# Altium schematic sheet MCUs.SchDoc
size B; SheetNumber: 8; SheetTotal: 8
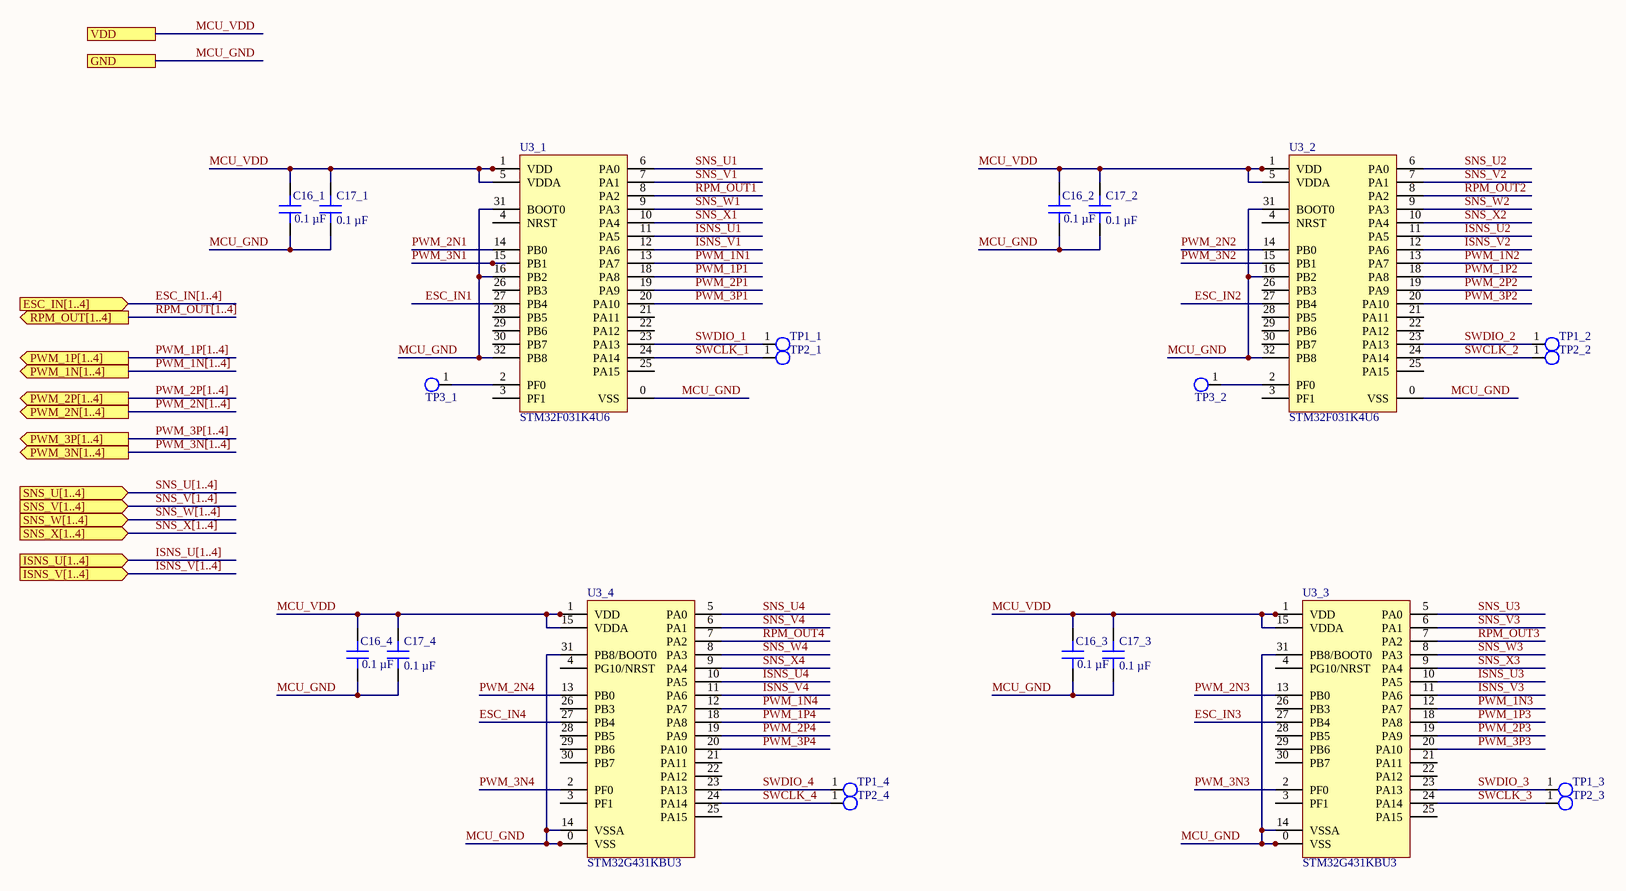
[diagram p0: MCUs.SchDoc]

## Parts
C16_1  0.1 µF  [CAP 0402_1005]
C16_2  0.1 µF  [CAP 0402_1005]
C16_3  0.1 µF  [CAP 0402_1005]
C16_4  0.1 µF  [CAP 0402_1005]
C17_1  0.1 µF  [CAP 0402_1005]
C17_2  0.1 µF  [CAP 0402_1005]
C17_3  0.1 µF  [CAP 0402_1005]
C17_4  0.1 µF  [CAP 0402_1005]
TP1_1  0.635mm  [TP  0.635mm]  (value not drawn)
TP1_2  0.635mm  [TP  0.635mm]  (value not drawn)
TP1_3  0.635mm  [TP  0.635mm]  (value not drawn)
TP1_4  0.635mm  [TP  0.635mm]  (value not drawn)
TP2_1  0.635mm  [TP  0.635mm]  (value not drawn)
TP2_2  0.635mm  [TP  0.635mm]  (value not drawn)
TP2_3  0.635mm  [TP  0.635mm]  (value not drawn)
TP2_4  0.635mm  [TP  0.635mm]  (value not drawn)
TP3_1  0.635mm  [TP  0.635mm]  (value not drawn)
TP3_2  0.635mm  [TP  0.635mm]  (value not drawn)
U3_1  STM32F031K4U6  [QFN50P400X400X60-32N]
U3_2  STM32F031K4U6  [QFN50P400X400X60-32N]
U3_3  STM32G431KBU3  [QFN50P400X400X60-32N]
U3_4  STM32G431KBU3  [QFN50P400X400X60-32N]

## Ports
ESC_IN[1..4] (in), GND, ISNS_U[1..4] (in), ISNS_V[1..4] (in), PWM_1N[1..4] (out), PWM_1P[1..4] (out), PWM_2N[1..4] (out), PWM_2P[1..4] (out), PWM_3N[1..4] (out), PWM_3P[1..4] (out), RPM_OUT[1..4] (out), SNS_U[1..4] (in), SNS_V[1..4] (in), SNS_W[1..4] (in), SNS_X[1..4] (in), VDD

## Nets
ESC_IN1: U3_1.27(PB4)
ESC_IN2: U3_2.27(PB4)
ESC_IN3: U3_3.27(PB4)
ESC_IN4: U3_4.27(PB4)
ISNS_U1: U3_1.11(PA5)
ISNS_U2: U3_2.11(PA5)
ISNS_U3: U3_3.10(PA5)
ISNS_U4: U3_4.10(PA5)
ISNS_V1: U3_1.12(PA6)
ISNS_V2: U3_2.12(PA6)
ISNS_V3: U3_3.11(PA6)
ISNS_V4: U3_4.11(PA6)
MCU_GND: C16_1.1 C16_2.1 C16_3.1 C16_4.1 C17_1.1 C17_2.1 C17_3.1 C17_4.1 U3_1.0(VSS) U3_1.16(PB2) U3_1.31(BOOT0) U3_1.32(PB8) U3_2.0(VSS) U3_2.16(PB2) U3_2.31(BOOT0) U3_2.32(PB8) U3_3.0(VSS) U3_3.14(VSSA) U3_3.16(VSS) U3_3.31(PB8/BOOT0) U3_3.32(VSS) U3_4.0(VSS) U3_4.14(VSSA) U3_4.16(VSS) U3_4.31(PB8/BOOT0) U3_4.32(VSS) ; port GND
MCU_VDD: C16_1.2 C16_2.2 C16_3.2 C16_4.2 C17_1.2 C17_2.2 C17_3.2 C17_4.2 U3_1.1(VDD) U3_1.5(VDDA) U3_1.17(VDD) U3_2.1(VDD) U3_2.5(VDDA) U3_2.17(VDD) U3_3.1(VDD) U3_3.15(VDDA) U3_3.17(VDD) U3_4.1(VDD) U3_4.15(VDDA) U3_4.17(VDD) ; port VDD
PWM_1N1: U3_1.13(PA7)
PWM_1N2: U3_2.13(PA7)
PWM_1N3: U3_3.12(PA7)
PWM_1N4: U3_4.12(PA7)
PWM_1P1: U3_1.18(PA8)
PWM_1P2: U3_2.18(PA8)
PWM_1P3: U3_3.18(PA8)
PWM_1P4: U3_4.18(PA8)
PWM_2N1: U3_1.14(PB0)
PWM_2N2: U3_2.14(PB0)
PWM_2N3: U3_3.13(PB0)
PWM_2N4: U3_4.13(PB0)
PWM_2P1: U3_1.19(PA9)
PWM_2P2: U3_2.19(PA9)
PWM_2P3: U3_3.19(PA9)
PWM_2P4: U3_4.19(PA9)
PWM_3N1: U3_1.15(PB1)
PWM_3N2: U3_2.15(PB1)
PWM_3N3: U3_3.2(PF0)
PWM_3N4: U3_4.2(PF0)
PWM_3P1: U3_1.20(PA10)
PWM_3P2: U3_2.20(PA10)
PWM_3P3: U3_3.20(PA10)
PWM_3P4: U3_4.20(PA10)
RPM_OUT1: U3_1.8(PA2)
RPM_OUT2: U3_2.8(PA2)
RPM_OUT3: U3_3.7(PA2)
RPM_OUT4: U3_4.7(PA2)
SNS_U1: U3_1.6(PA0)
SNS_U2: U3_2.6(PA0)
SNS_U3: U3_3.5(PA0)
SNS_U4: U3_4.5(PA0)
SNS_V1: U3_1.7(PA1)
SNS_V2: U3_2.7(PA1)
SNS_V3: U3_3.6(PA1)
SNS_V4: U3_4.6(PA1)
SNS_W1: U3_1.9(PA3)
SNS_W2: U3_2.9(PA3)
SNS_W3: U3_3.8(PA3)
SNS_W4: U3_4.8(PA3)
SNS_X1: U3_1.10(PA4)
SNS_X2: U3_2.10(PA4)
SNS_X3: U3_3.9(PA4)
SNS_X4: U3_4.9(PA4)
SWCLK_1: TP2_1.1(TP) U3_1.24(PA14)
SWCLK_2: TP2_2.1(TP) U3_2.24(PA14)
SWCLK_3: TP2_3.1(TP) U3_3.24(PA14)
SWCLK_4: TP2_4.1(TP) U3_4.24(PA14)
SWDIO_1: TP1_1.1(TP) U3_1.23(PA13)
SWDIO_2: TP1_2.1(TP) U3_2.23(PA13)
SWDIO_3: TP1_3.1(TP) U3_3.23(PA13)
SWDIO_4: TP1_4.1(TP) U3_4.23(PA13)
NetTP3_1_1: TP3_1.1(TP) U3_1.2(PF0)
NetTP3_2_1: TP3_2.1(TP) U3_2.2(PF0)

Not connected (* = marked no-connect by the designer): U3_1 3(PF1) 4(NRST) 21(PA11) 22(PA12) 25(PA15) 26(PB3) 28(PB5) 29(PB6) 30(PB7); U3_2 3(PF1) 4(NRST) 21(PA11) 22(PA12) 25(PA15) 26(PB3) 28(PB5) 29(PB6) 30(PB7); U3_3 3(PF1) 4(PG10/NRST) 21(PA11) 22(PA12) 25(PA15) 26(PB3) 28(PB5) 29(PB6) 30(PB7); U3_4 3(PF1) 4(PG10/NRST) 21(PA11) 22(PA12) 25(PA15) 26(PB3) 28(PB5) 29(PB6) 30(PB7)

## Buses and harness runs
bus ESC_IN[1..4] = port ESC_IN[1..4]
bus ISNS_U[1..4] = port ISNS_U[1..4]
bus ISNS_V[1..4] = port ISNS_V[1..4]
bus PWM_1N[1..4] = port PWM_1N[1..4]
bus PWM_1P[1..4] = port PWM_1P[1..4]
bus PWM_2N[1..4] = port PWM_2N[1..4]
bus PWM_2P[1..4] = port PWM_2P[1..4]
bus PWM_3N[1..4] = port PWM_3N[1..4]
bus PWM_3P[1..4] = port PWM_3P[1..4]
bus RPM_OUT[1..4] = port RPM_OUT[1..4]
bus SNS_U[1..4] = port SNS_U[1..4]
bus SNS_V[1..4] = port SNS_V[1..4]
bus SNS_W[1..4] = port SNS_W[1..4]
bus SNS_X[1..4] = port SNS_X[1..4]

## Library data of the parts
C16_1-C16_4 C17_1-C17_4 = C0402C104K4RACAUTO: CAP CER 0.1UF 16V X7R 0402; manufacturer: KEMET; Tolerance: ±10%; Part Number: C0402C104K4RACAUTO; Value: 0.1 µF; Applications: Automotive, Bypass, Decoupling; Capacitance: 0.1 µF; componentlink1description: Datasheet; componentlink1url: https://api.kemet.com/component-edge/download/specsheet/C0402C104K4RACAUTO.pdf; componentlink2description: DigiKey Link; componentlink2url: https://www.digikey.com/en/products/detail/kemet/C0402C104K4RACAUTO/3314827; Device Package: 0402 (1005 Metric); lastupdated: 8/14/2022 9:05:51 PM; Lifecycle Status: Active; Minimum Order: 1; Mounting Type: Surface Mount, MLCC; Operating Temperature: -55°C ~ 125°C; Package / Case: 0402 (1005 Metric); packaging: TapeAndReel; partid: 3024; Part Status: Active; price: 0.01; Ratings: AEC-Q200; series: SMD Auto X7R; Size / Dimension: 0.039" L x 0.020" W (1.00mm x 0.50mm); Supplier 1: DigiKey; Supplier Part Number 1: 399-6828-1-ND; Temperature Coefficient: X7R; Thickness (Max): 0.022" (0.55mm); Voltage - Rated: 16V
TP1_1-TP1_4 TP2_1-TP2_4 TP3_1 TP3_2 = TP 0.635mm: Test point
U3_1 U3_2 = STM32F031K4U6: MCU UFQFPN-32
U3_3 U3_4 = STM32G431KBU3: MCU UFQFPN-32